# EAGLE schematic Joystickv13 (EAGLE 7.2.0)
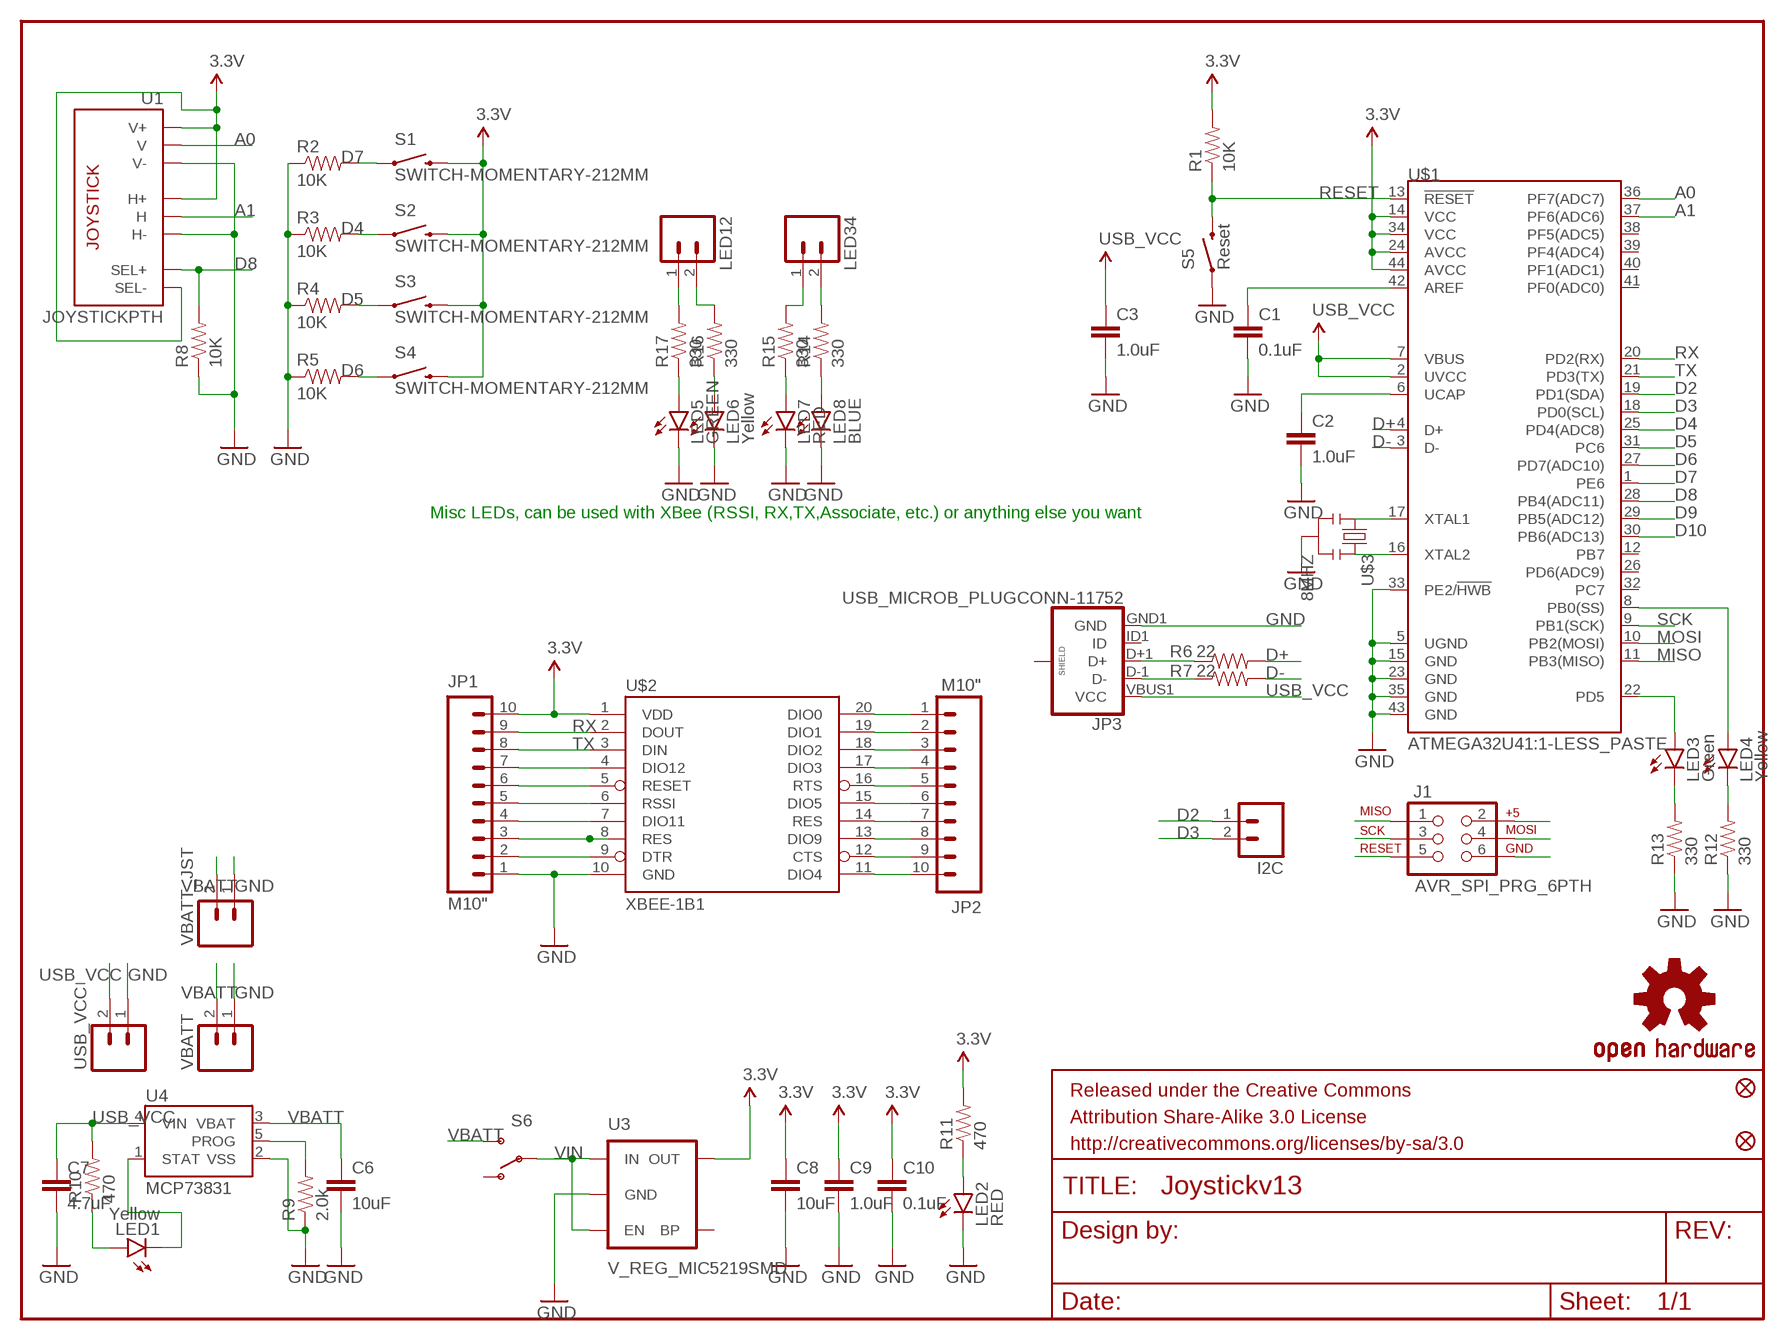
[diagram p0: schematic, sheet 1]

## Parts
C1  0.1uF  0.1UF-25V(+80/-20%)(0603)  [0603-CAP]
C2  1.0uF  1.0UF-16V-10%(0603)  [0603-CAP]
C3  1.0uF  1.0UF-16V-10%(0603)  [0603-CAP]
C6  10uF  10UF-6.3V-20%(0603)  [0603-CAP]
C7  4.7uF  4.7UF-6.3V-10%(0603)0603  [0603-CAP]
C8  10uF  10UF-6.3V-20%(0603)  [0603-CAP]
C9  1.0uF  1.0UF-16V-10%(0603)  [0603-CAP]
C10  0.1uF  0.1UF-25V(+80/-20%)(0603)  [0603-CAP]
FID1  FIDUCIALUFIDUCIAL  [MICRO-FIDUCIAL]
FID2  FIDUCIALUFIDUCIAL  [MICRO-FIDUCIAL]
I2C  M02PTH  [1X02]
J1  AVR_SPI_PRG_6PTH  [2X3]
JP1  M10"  [1X10]
JP2  M10"  [1X10]
JP3  USB_MICROB_PLUGCONN-11752  [USB-B-MICRO-SMD_V03]
LED1  Yellow  LED-YELLOW0603  [LED-0603]
LED2  RED  LED-RED0603  [LED-0603]
LED3  Green  LED-GREEN0603  [LED-0603]
LED4  Yellow  LED-YELLOW0603  [LED-0603]
LED5  GREEN  LED-GREEN0603  [LED-0603]
LED6  Yellow  LED-YELLOW0603  [LED-0603]
LED7  RED  LED-RED0603  [LED-0603]
LED8  BLUE  LED-BLUE0603  [LED-0603]
LED12  M02PTH  [1X02]
LED34  M02PTH  [1X02]
LOGO1  OSHW-LOGOM  [OSHW-LOGO-M]
R1  10K  10KOHM-1/10W-1%(0603)0603  [0603-RES]
R2  10K  10KOHM-1/10W-1%(0603)0603  [0603-RES]
R3  10K  10KOHM-1/10W-1%(0603)0603  [0603-RES]
R4  10K  10KOHM-1/10W-1%(0603)0603  [0603-RES]
R5  10K  10KOHM-1/10W-1%(0603)0603  [0603-RES]
R6  22  22OHM1/10W1%(0603)  [0603-RES]
R7  22  22OHM1/10W1%(0603)  [0603-RES]
R8  10K  10KOHM-1/10W-1%(0603)0603  [0603-RES]
R9  2.0k  2.0KOHM1/10W5%(0603)  [0603-RES]
R10  470  470OHM1/10W1%(0603)  [0603-RES]
R11  470  470OHM1/10W1%(0603)  [0603-RES]
R12  330  330OHM1/10W1%(0603)  [0603-RES]
R13  330  330OHM1/10W1%(0603)  [0603-RES]
R14  330  330OHM1/10W1%(0603)  [0603-RES]
R15  330  330OHM1/10W1%(0603)  [0603-RES]
R16  330  330OHM1/10W1%(0603)  [0603-RES]
R17  330  330OHM1/10W1%(0603)  [0603-RES]
S1  SWITCH-MOMENTARY-212MM  [TACTILE-PTH-12MM]
S2  SWITCH-MOMENTARY-212MM  [TACTILE-PTH-12MM]
S3  SWITCH-MOMENTARY-212MM  [TACTILE-PTH-12MM]
S4  SWITCH-MOMENTARY-212MM  [TACTILE-PTH-12MM]
S5  Reset  SWITCH-MOMENTARY-2SMD  [TACTILE-SWITCH-SMD]
S6  SWITCH-SPDTPTH  [SWITCH-SPDT]
U1  JOYSTICKPTH  [JOYSTICK]
U3  V_REG_MIC5219SMD  [SOT23-5]
U4  MCP73831  [SOT23-5]
U$1  ATMEGA32U41:1-LESS_PASTE  [QFN-44-NOPAD_1:1-LESS_PASTE]
U$2  XBEE-1B1  [XBEE-1]
U$3  8MHZ  RESONATOR8MHZ  [RESONATOR-SMD]
USB_VCC  M02PTH  [1X02]
VBATT  M02PTH  [1X02]
VBATT_JST  M02-JST-2MM-SMT  [JST-2-SMD]

## Nets
3.3V: C8.1 C9.1 C10.1 J1.2 JP1.10 R1.2 R11.2 S1.3 S2.3 S3.3 S4.3 U1.B2A(SEL-) U1.H1(H+) U1.V1(V+) U3.5(OUT) U$1.14(VCC) U$1.24(AVCC) U$1.34(VCC) U$1.44(AVCC) U$2.1(VDD)
A0: U1.V2(V) U$1.36(PF7(ADC7))
A1: U1.H2(H) U$1.37(PF6(ADC6))
D2: I2C.1 U$1.19(PD1(SDA))
D3: I2C.2 U$1.18(PD0(SCL))
D4: R3.2 S2.1 U$1.25(PD4(ADC8))
D5: R4.2 S3.1 U$1.31(PC6)
D6: R5.2 S4.1 U$1.27(PD7(ADC10))
D7: R2.2 S1.1 U$1.1(PE6)
D8: R8.2 U1.B1A(SEL+) U$1.28(PB4(ADC11))
D9: U$1.29(PB5(ADC12))
D10: U$1.30(PB6(ADC13))
D+: R6.2 U$1.4(D+)
D-: R7.2 U$1.3(D-)
GND: C1.2 C2.2 C3.2 C6.2 C7.2 C8.2 C9.2 C10.2 J1.6 JP1.1 JP3.GND1(GND) LED2.C LED5.C LED6.C LED7.C LED8.C R2.1 R3.1 R4.1 R5.1 R8.1 R9.1 R12.1 R13.1 S5.1 U1.H3(H-) U1.V3(V-) U3.2(GND) U4.2(VSS) U$1.5(UGND) U$1.15(GND) U$1.23(GND) U$1.33(PE2/!HWB) U$1.35(GND) U$1.43(GND) U$2.10(GND) U$3.2 USB_VCC.1 VBATT.1 VBATT_JST.1
MISO: J1.1 U$1.11(PB3(MISO))
MOSI: J1.4 U$1.10(PB2(MOSI))
N$1: U$1.17(XTAL1) U$3.1
N$2: C1.1 U$1.42(AREF)
N$3: JP3.D+1(D+) R6.1
N$4: JP1.2 U$2.9(DTR)
N$5: C2.1 U$1.6(UCAP)
N$6: U$1.16(XTAL2) U$3.3
N$8: JP1.3 U$2.8(RES)
N$9: JP3.D-1(D-) R7.1
N$10: JP1.4 U$2.7(DIO11)
N$11: R9.2 U4.5(PROG)
N$12: JP1.5 U$2.6(RSSI)
N$13: JP1.6 U$2.5(RESET)
N$14: JP1.7 U$2.4(DIO12)
N$15: JP2.10 U$2.11(DIO4)
N$16: JP2.9 U$2.12(CTS)
N$17: JP2.8 U$2.13(DIO9)
N$18: JP2.7 U$2.14(RES)
N$19: JP2.6 U$2.15(DIO5)
N$20: JP2.5 U$2.16(RTS)
N$21: JP2.4 U$2.17(DIO3)
N$23: JP2.3 U$2.18(DIO2)
N$24: JP2.2 U$2.19(DIO1)
N$25: JP2.1 U$2.20(DIO0)
N$26: LED2.A R11.1
N$27: LED1.A R10.1
N$28: LED1.C U4.1(STAT)
N$29: LED4.A U$1.8(PB0(SS))
N$30: LED4.C R12.2
N$31: LED3.C R13.2
N$32: LED3.A U$1.22(PD5)
N$33: LED12.1 R17.2
N$34: LED8.A R14.1
N$35: LED7.A R15.1
N$36: LED6.A R16.1
N$37: LED5.A R17.1
N$38: LED12.2 R16.2
N$39: LED34.1 R15.2
N$40: LED34.2 R14.2
RESET: J1.5 R1.1 S5.3 U$1.13(!RESET)
RX: JP1.9 U$1.20(PD2(RX)) U$2.2(DOUT)
SCK: J1.3 U$1.9(PB1(SCK))
TX: JP1.8 U$1.21(PD3(TX)) U$2.3(DIN)
USB_VCC: C3.1 C7.1 JP3.VBUS1(VCC) R10.2 U4.4(VIN) U$1.2(UVCC) U$1.7(VBUS) USB_VCC.2
VBATT: C6.1 S6.3(S) U4.3(VBAT) VBATT.2 VBATT_JST.2
VIN: S6.2(P) U3.1(IN) U3.3(EN)
Unconnected: JP3.ID1(ID) JP3.SHIELD1(SHIELD) JP3.SHIELD2(SHIELD) JP3.SHIELD3(SHIELD) S6.1(O) U3.4(BP) U$1.12(PB7) U$1.26(PD6(ADC9)) U$1.32(PC7) U$1.38(PF5(ADC5)) U$1.39(PF4(ADC4)) U$1.40(PF1(ADC1)) U$1.41(PF0(ADC0))

## Notes on the sheet
- Misc LEDs, can be used with XBee (RSSI, RX,TX,Associate, etc.) or anything else you want

## Library data of the parts
C1 C10 = SparkFun-Capacitors:0.1UF-25V(+80/-20%)(0603): CAP-00810 Ceramic Standard decoupling cap; PROD_ID: CAP-00810
C2 C3 C9 = SparkFun-Capacitors:1.0UF-16V-10%(0603): CAP-00868; PROD_ID: CAP-00868
C6 C8 = SparkFun-Capacitors:10UF-6.3V-20%(0603): CAP-11015; PROD_ID: CAP-11015
C7 = SparkFun-Capacitors:4.7UF-6.3V-10%(0603): CAP-08280; PROD_ID: CAP-08280
FID1 FID2 = SparkFun-Aesthetics:FIDUCIAL: Fiducial Alignment Points Various fiducial points for machine vision alignment.
I2C LED12 LED34 USB_VCC VBATT VBATT_JST = SparkFun-Connectors:M02: Header 2 Standard 2-pin 0.1" header. Use with straight break away headers (SKU : PRT-00116), right angle break away headers (PRT-00553), swiss pins (PRT-00743), machine pins (PRT-00117), and female headers (PRT-00115). Molex polarized connector foot print use with SKU : PRT-08233 with associated crimp pins and housings.
J1 = SparkFun-Connectors:AVR_SPI_PRG_6: AVR ISP 6 Pin This is the reduced ISP connector for AVR programming. Common on Arduino. This footprint will take up less PCB space and can be used with a 10-pin to 6-pin adapter such as SKU: BOB-08508
JP1 JP2 = SparkFun-Connectors:M10: Header 10 Standard 10-pin 0.1" header. Use with straight break away headers (SKU : PRT-00116), right angle break away headers (PRT-00553), swiss pins (PRT-00743), machine pins (PRT-00117), and female headers (PRT-00115).
JP3 = SparkFun-Connectors:USB_MICROB_PLUG: USB Micro-B connectors Some male, some female. Watch your step!; PROD_ID: CONN-11752
LED1 LED4 LED6 = SparkFun-LED:LED-YELLOW: Yellow SMD LEDs LilyPad 1206- DIO-09909 0603- DIO-09003; PROD_ID: DIO-09003
LED2 LED7 = SparkFun-LED:LED-RED: Assorted Red LEDs LilyPad 1206- DIO-09912 1206- DIO-00809 0603- DIO-00819; PROD_ID: DIO-00819
LED3 = SparkFun-LED:LED-GREEN: Various green LEDs Green LEDs used in SFE Production 0603- DIO-00821 LARGE- DIO-00862 LILYPAD- DIO-09910; PROD_ID: DIO-00821; VALUE: GREEN
LED5 = SparkFun-LED:LED-GREEN: Various green LEDs Green LEDs used in SFE Production 0603- DIO-00821 LARGE- DIO-00862 LILYPAD- DIO-09910; PROD_ID: DIO-00821
LED8 = SparkFun-LED:LED-BLUE: Blue LEDs for production use Various blue LEDs stocked by SparkFun production 0603 - DIO-08575 Rebel - DIO-09553 1206 - DIO-09911; PROD_ID: DIO-08575
LOGO1 = SparkFun-Aesthetics:OSHW-LOGO: Open Source Hardware Logo This logo indicates the piece of hardware it is found on incorporates a OSHW license and/or adheres to the definition of open source hardware found here: http://freedomdefined.org/OSHW
R1-R5 R8 = SparkFun-Resistors:10KOHM-1/10W-1%(0603): RES-00824; PROD_ID: RES-00824
R6 R7 = SparkFun-Resistors:22OHM1/10W1%(0603): RES-08698; PROD_ID: RES-08698
R9 = SparkFun-Resistors:2.0KOHM1/10W5%(0603): RES-08296; PROD_ID: RES-08296
R10 R11 = SparkFun-Resistors:470OHM1/10W1%(0603): RES-07869; PROD_ID: RES-07869
R12-R17 = SparkFun-Resistors:330OHM1/10W1%(0603): RES-00818; PROD_ID: RES-00818
S1-S4 = SparkFun-Electromechanical:SWITCH-MOMENTARY-2: Various NO switches- pushbuttons, reed, etc; PROD_ID: SWCH-09185
S5 = SparkFun-Electromechanical:SWITCH-MOMENTARY-2: Various NO switches- pushbuttons, reed, etc; PROD_ID: SWCH-08247
S6 = SparkFun-Electromechanical:SWITCH-SPDT: SPDT Switch Simple slide switch, Spark Fun Electronics SKU : COM-00102 DPDT SMT slide switch, AYZ0202, SWCH-08179; PROD_ID: SWCH-08261
U1 = SparkFun-Electromechanical:JOYSTICK: Thumb Joystick Joystick commonly found in PS2 controllers. Two pots and a select switch. Footprint proven. Spark Fun Electronics SKU : COM-09032
U3 = SparkFun-PowerIC:V_REG_MIC5219: V_REG MIC5219 Standard 500mA LDO voltage regulator in SOT-23 layout. Micrel part MIC5219. BP (by-pass) pin is used to lower output noise with 470pF cap, may be left open.
U4 = SparkFun-PowerIC:MCP73831: Miniature single cell, fully integrated Li-Ion, Li-polymer charge management controller http://ww1.microchip.com/downloads/en/DeviceDoc/21984a.pdf IC-09995; PROD_ID: IC-09995
U$1 = SparkFun-DigitalIC:ATMEGA32U4: Atmel 44-pin 8-bit Microcontroller with 32KBytes of ISP Flash and USB Controller
U$2 = SparkFun-RF:XBEE-1: Xbee module footprints
U$3 = SparkFun-FreqCtrl:RESONATOR: Resonator Small SMD resonator. Used, eg, on the Arduino Pro/ Pro Mini boards. 8MHz- XTAL-08895 16MHz- XTAL-08900; PROD_ID: XTAL-08895